# Altium schematic sheet EU_Sensors.SchDoc
size A4; SheetNumber: 6; SheetTotal: 6
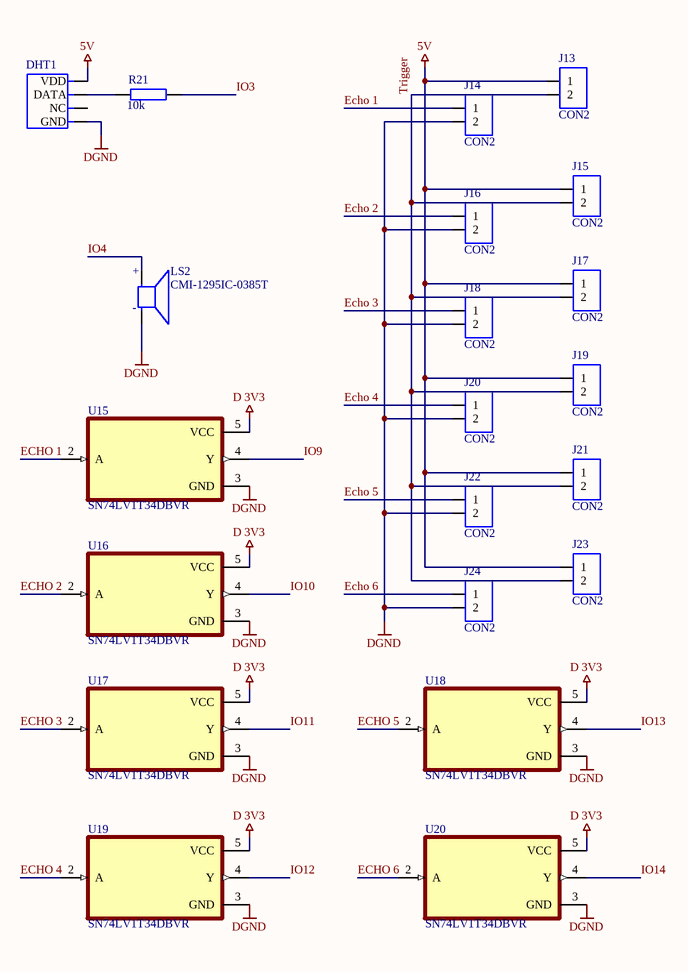
[diagram p0: EU_Sensors.SchDoc]

## Parts
DHT1  TEM-HUM-DHT11(4P-15.5X12.0MM)  [SNR4-2.54-15.5X12.0X5.5MM]  (value not drawn)
J13  CON2  [SIP-2]
J14  CON2  [SIP-2]
J15  CON2  [SIP-2]
J16  CON2  [SIP-2]
J17  CON2  [SIP-2]
J18  CON2  [SIP-2]
J19  CON2  [SIP-2]
J20  CON2  [SIP-2]
J21  CON2  [SIP-2]
J22  CON2  [SIP-2]
J23  CON2  [SIP-2]
J24  CON2  [SIP-2]
LS2  CMI-1295IC-0385T  [CUI_CMI-1295IC-0385T]
R21  value 10k  [Axial-0.4]  (hidden comment: RES)
U15  SN74LV1T34DBVR  [SOT95P280X145-5N]
U16  SN74LV1T34DBVR  [SOT95P280X145-5N]
U17  SN74LV1T34DBVR  [SOT95P280X145-5N]
U18  SN74LV1T34DBVR  [SOT95P280X145-5N]
U19  SN74LV1T34DBVR  [SOT95P280X145-5N]
U20  SN74LV1T34DBVR  [SOT95P280X145-5N]

## Nets
5V: DHT1.1(VDD) J13.1 J15.1 J17.1 J19.1 J21.1 J23.1
D 3V3: U15.5(VCC) U16.5(VCC) U17.5(VCC) U18.5(VCC) U19.5(VCC) U20.5(VCC)
DGND: DHT1.4(GND) J14.2 J16.2 J18.2 J20.2 J22.2 J24.2 LS2.N U15.3(GND) U16.3(GND) U17.3(GND) U18.3(GND) U19.3(GND) U20.3(GND)
Echo 1: J14.1 U15.2(A)
Echo 2: J16.1 U16.2(A)
Echo 3: J18.1 U17.2(A)
Echo 4: J20.1 U19.2(A)
Echo 5: J22.1 U18.2(A)
Echo 6: J24.1 U20.2(A)
IO3: R21.2
IO4: LS2.P
IO9: U15.4(Y)
IO10: U16.4(Y)
IO11: U17.4(Y)
IO12: U19.4(Y)
IO13: U18.4(Y)
IO14: U20.4(Y)
Trigger: J13.2 J15.2 J17.2 J19.2 J21.2 J23.2
NetDHT1_2: DHT1.2(DATA) R21.1

Not connected (* = marked no-connect by the designer): DHT1 3(NC)

## Notes on the sheet
- (in symbol CMI-1295IC-0385T) +; -

## Library data of the parts
DHT1 = TEM-HUM-DHT11(4P-15.5X12.0MM): Äá»™ áº©m, nhiá»‡t Ä‘á»™ Ká»¹ thuáº­t sá»‘ Â±5% RH qua lá»—; MF: UNIVERSAL-SOLDER Electronics Ltd; MP: DHT11; SnapEDA_Link: https://www.snapeda.com/parts/DHT11/UNIVERSAL-SOLDER+Electronics+Ltd/view-part/?ref=snap; Package: None; Value: *; Check_prices: https://www.snapeda.com/parts/DHT11/UNIVERSAL-SOLDER+Electronics+Ltd/view-part/?ref=eda
J13-J24 = CON2: Stecker
LS2 = CMI-1295IC-0385T: 12 mm, 3 Vdc, 85 dB, Through Hole, Driving Circuit, Magnetic Audio Indicator Buzzer; MF: Same Sky; SnapEDA_Link: https://www.snapeda.com/parts/CMI-1295IC-0385T/Same+Sky/view-part/?ref=snap; Package: Package; Value: *; MP: CMI-1295IC-0385T; Check_prices: https://www.snapeda.com/parts/CMI-1295IC-0385T/Same+Sky/view-part/?ref=eda
R21 = RES: Widerstand
U15-U20 = SN74LV1T34DBVR: Single Power Supply BUFFER Logic Level Shifter (no enable); MF: Texas Instruments; SnapEDA_Link: https://www.snapeda.com/parts/SN74LV1T34DBVR/Texas+Instruments/view-part/?ref=snap; Package: SOT-23-5 Texas Instruments; Value: *; MP: SN74LV1T34DBVR; Check_prices: https://www.snapeda.com/parts/SN74LV1T34DBVR/Texas+Instruments/view-part/?ref=eda